# EAGLE schematic servoUART by Raspberry Pi3_V2 (EAGLE 8.3.2)
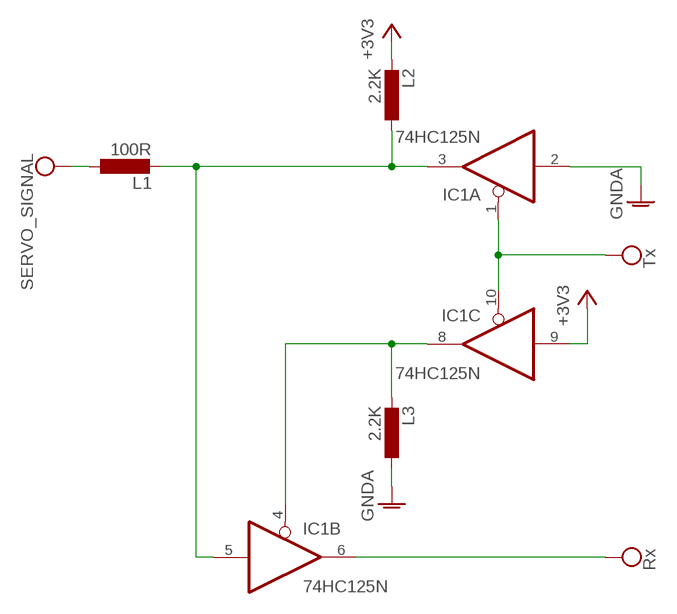
[diagram p0: schematic, sheet 1]

## Parts
IC1  74HC125N  [DIL14]
L1  100R  L-EU0204/5  [0204/5]
L2  2.2K  L-EU0204/5  [0204/5]
L3  2.2K  L-EU0204/5  [0204/5]

## Nets
+3V3: IC1.9(C:I) L2.2
GNDA: IC1.2(A:I) L3.1
N$1: IC1.3(A:O) IC1.5(B:I) L1.2 L2.1
N$2: IC1.4(B:OE) IC1.8(C:O) L3.2
VSS: IC1.1(A:OE) IC1.6(B:O) IC1.10(C:OE) L1.1 ; supply symbol labelled SERVO_SIGNAL, Tx, Rx
Unconnected: IC1.11(D:O) IC1.12(D:I) IC1.13(D:OE)

## Power pins joined to a net without a drawn wire
GND: IC1.7(P:GND)
VCC: IC1.14(P:VCC)

## Library data of the parts
IC1 = 74xx-eu:74*125: Quad bus BUFFER, 3-state
L1-L3 = rcl:L-EU: INDUCTOR, European symbol